# EAGLE schematic melody generator (EAGLE 6.5.0)
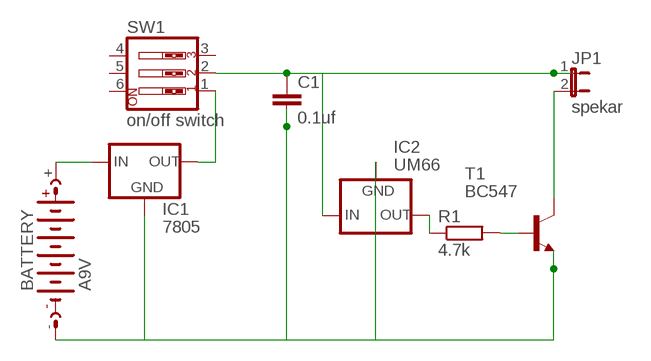
[diagram p0: schematic, sheet 1]

## Parts
BATTERY  A9V  AB9V  [AB9V]
C1  0.1uf  C2.5/2  [C2.5-2]
IC1  7805  78XXL  [78XXL]
IC2  UM66  79LXX  [79LXX]
JP1  spekar  JP1E  [JP1]
R1  4.7k  R-EU_0204/7  [0204/7]
SW1  on/off switch  SW_DIP-3  [EDG-03]
T1  BC547  [TO92]

## Nets
N$1: IC2.OUT R1.1
N$2: R1.2 T1.2(B)
N$3: BATTERY.+ IC1.IN
N$4: BATTERY.- C1.2 IC1.GND IC2.GND T1.1(E)
N$5: IC1.OUT SW1.1
N$6: C1.1 IC2.IN JP1.1 SW1.2
N$7: JP1.2 T1.3(C)
Unconnected: SW1.3 SW1.4 SW1.5 SW1.6

## Library data of the parts
BATTERY = battery:AB9V: 9-V BATTERY CLIP
C1 = capacitor-wima:C: CAPACITOR naming: grid - package width
IC1 = v-reg:78XXL: VOLTAGE REGULATOR
IC2 = v-reg:79LXX: VOLTAGE REGULATOR
JP1 = jumper:JP1E: JUMPER
R1 = rcl:R-EU_: RESISTOR, European symbol
SW1 = special:SW_DIP-3: DIP SWITCH
T1 = transistor:BC547: NPN TRANSISTOR